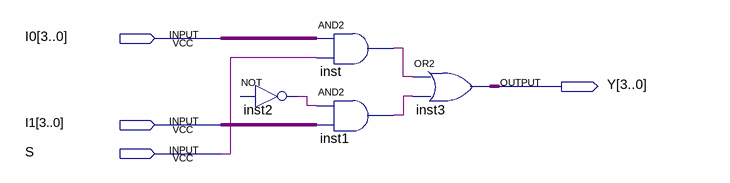
[diagram p0: schematic sheet]
// Quartus schematic BUS_MUX_2X1.bdf as structural Verilog: 4 symbols, 4 pins
module BUS_MUX_2X1 (
  input  [3:0] I0,
  input  [3:0] I1,
  input  S,
  output [3:0] Y
);

  wire inst1_out, inst2_out, inst_out;

  // NOT inst2 has open pins: IN=open, OUT=inst2_out
  assign inst_out = I0 & {4{S}};  // AND2 inst, 4 bits wide
  assign inst1_out = {4{inst2_out}} & I1;  // AND2 inst1, 4 bits wide
  assign Y = {4{inst_out}} | {4{inst1_out}};  // OR2 inst3, 4 bits wide
endmodule
